# EAGLE design Prototipo_2.0 (EAGLE 6.1)
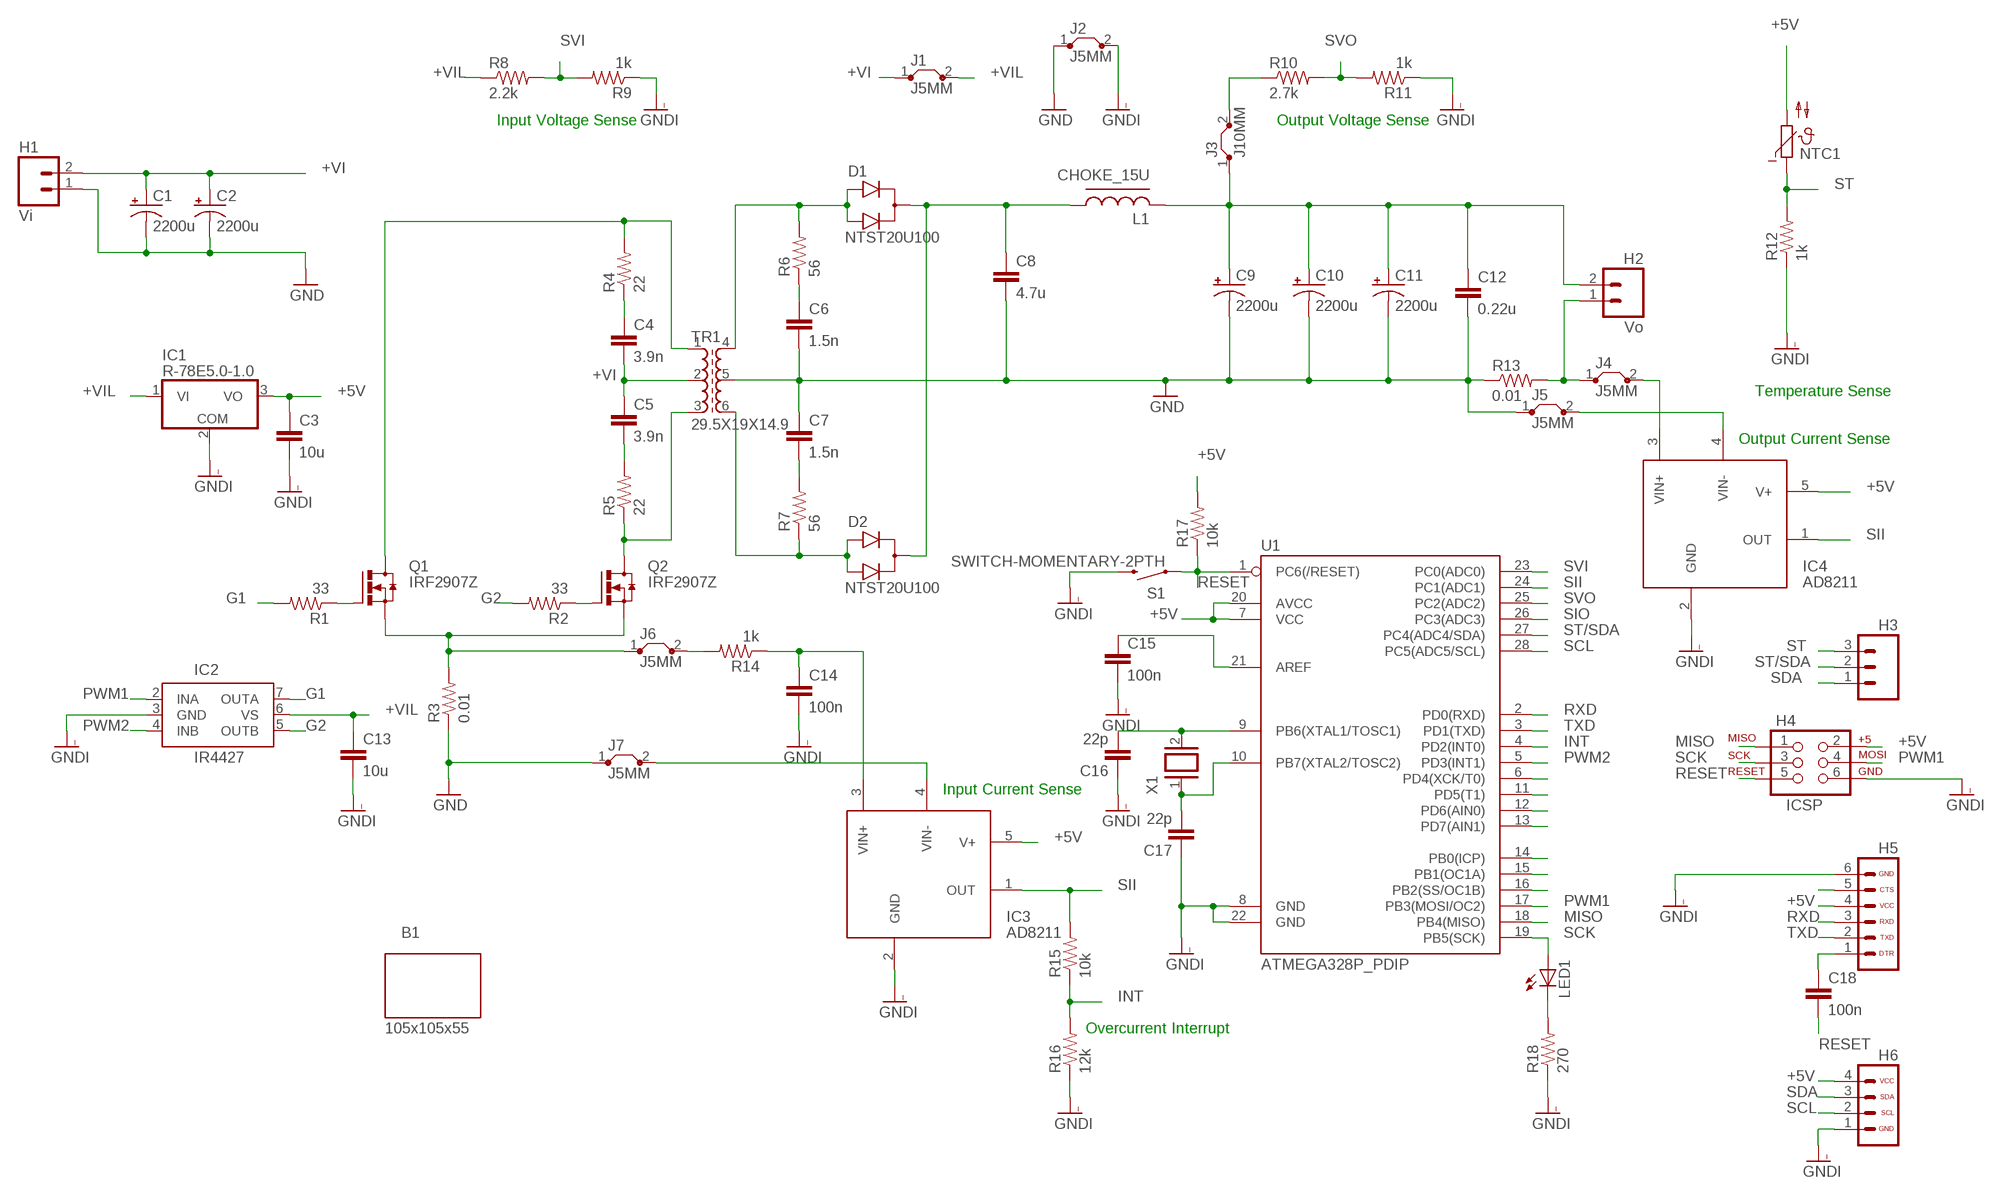
[diagram p0: schematic, sheet 1]

## Parts
B1  105x105x55  BOX_105X105X55  [BOX_105X105X55]
C1  2200u  CPOL_12.5MM_5MM  [CPOL_RADIAL_12.5MM_5MM]
C2  2200u  CPOL_12.5MM_5MM  [CPOL_RADIAL_12.5MM_5MM]
C3  10u  C5/2.5  [C5B2.5]
C4  3.9n  C7.5/3  [C7.5B3]
C5  3.9n  C7.5/3  [C7.5B3]
C6  1.5n  C7.5/3  [C7.5B3]
C7  1.5n  C7.5/3  [C7.5B3]
C8  4.7u  C5/2.5  [C5B2.5]
C9  2200u  CPOL_12.5MM_5MM  [CPOL_RADIAL_12.5MM_5MM]
C10  2200u  CPOL_12.5MM_5MM  [CPOL_RADIAL_12.5MM_5MM]
C11  2200u  CPOL_12.5MM_5MM  [CPOL_RADIAL_12.5MM_5MM]
C12  0.22u  C5/3  [C5B3]
C13  10u  C5/2.5  [C5B2.5]
C14  100n  C5/3  [C5B3]
C15  100n  C5/3  [C5B3]
C16  22p  C5/2.5  [C5B2.5]
C17  22p  C5/2.5  [C5B2.5]
C18  100n  C5/3  [C5B3]
D1  NTST20U100  NTST20U100CTG  [TO220V]
D2  NTST20U100  NTST20U100CTG  [TO220V]
H1  Vi  M025MM  [SCREWTERMINAL-5MM-2]
H2  Vo  M025MM  [SCREWTERMINAL-5MM-2]
H3  M03PTH  [1X03]
H4  ICSP  AVR_SPI_PRG_6PTH  [2X3]
H5  HEADER_SERIAL  [HEADER_SERIAL]
H6  HEADER_I2C  [HEADER_I2C]
IC1  R-78E5.0-1.0  [R-78E5.0-1.0]
IC2  IR4427  [DIL08]
IC3  AD8211  [RJ-5]
IC4  AD8211  [RJ-5]
J1  J5MM  [05]
J2  J5MM  [05]
J3  J10MM  [10]
J4  J5MM  [05]
J5  J5MM  [05]
J6  J5MM  [05]
J7  J5MM  [05]
L1  CHOKE_15U  [CHOKE_15U]
LED1  LED5MM  [LED5MM]
NTC1  NTC640  [P640]
Q1  IRF2907Z  [TO220V]
Q2  IRF2907Z  [TO220V]
R1  33  RESISTORPTH-1/4W  [AXIAL-0.4]
R2  33  RESISTORPTH-1/4W  [AXIAL-0.4]
R3  0.01  RSENSE  [RSENSE]
R4  22  RESISTORPTH-1/2W  [AXIAL-0.5]
R5  22  RESISTORPTH-1/2W  [AXIAL-0.5]
R6  56  RESISTORPTH-1/2W  [AXIAL-0.5]
R7  56  RESISTORPTH-1/2W  [AXIAL-0.5]
R8  2.2k  RESISTORPTH-1/4W  [AXIAL-0.4]
R9  1k  RESISTORPTH-1/4W  [AXIAL-0.4]
R10  2.7k  RESISTORPTH-1/4W  [AXIAL-0.4]
R11  1k  RESISTORPTH-1/4W  [AXIAL-0.4]
R12  1k  RESISTORPTH-1/4W  [AXIAL-0.4]
R13  0.01  RSENSE  [RSENSE]
R14  1k  RESISTORPTH-1/4W  [AXIAL-0.4]
R15  10k  RESISTORPTH-1/4W  [AXIAL-0.4]
R16  12k  RESISTORPTH-1/4W  [AXIAL-0.4]
R17  10k  RESISTORPTH-1/4W  [AXIAL-0.4]
R18  270  RESISTORPTH-1/4W  [AXIAL-0.4]
S1  SWITCH-MOMENTARY-2PTH  [TACTILE-PTH]
TR1  29.5X19X14.9  29.5X19X14.9_N87  [CORE_29.5X19X14.9]
U1  ATMEGA328P_PDIP  [DIL28-3]
X1  XTAL/S  [QS]

## Nets
$N1 [LVSHC]: C8.1 D1.2(C) D2.2(C) L1.1
+5V [LVLC]: C3.1 H4.2 H5.4(4_VCC) H6.4(4_VCC) IC1.3(VO) IC3.5(V+) IC4.5(V+) NTC1.2 R17.P$2 U1.7(VCC) U1.20(AVCC)
+VI [LVSHC]: C1.+ C2.+ C4.2 C5.1 H1.2 J1.1 TR1.2
+VIL [LVLC]: C13.1 IC1.1(VI) IC2.6(VS) J1.2 R8.P$1
G1 [LVLC]: IC2.7(OUTA) R1.P$2
G2 [LVLC]: IC2.5(OUTB) R2.P$2
GND [LVSHC]: C1.- C2.- C6.2 C7.1 C8.2 C9.- C10.- C11.- C12.2 H1.1 J2.1 J5.1 J7.1 R3.P$1 R13.P$1 TR1.5
GNDI [LVLC]: C3.2 C13.2 C14.2 C15.2 C16.1 C17.1 H4.6 H5.6(6_GND) H6.1(1_GND) IC1.2(COM) IC2.3(GND) IC3.2(GND) IC4.2(GND) J2.2 R9.P$1 R11.P$1 R12.P$1 R16.P$1 R18.P$1 S1.3 U1.8(GND) U1.22(GND)
INT [LVLC]: R15.P$1 R16.P$2 U1.4(PD2(INT0))
MISO [LVLC]: H4.1 U1.18(PB4(MISO))
N$1 [LVLC]: Q1.1(G) R1.P$1
N$2 [LVLC]: Q2.1(G) R2.P$1
N$3 [LVLC]: C18.1 H5.1(1_DTR)
N$4 [LVHC]: C7.2 R7.P$2
N$5 [LVHC]: C5.2 R5.P$2
N$6 [LVLC]: H5.5(5_CTS)
N$11 [LVLC]: U1.6(PD4(XCK/T0))
N$12 [LVLC]: U1.11(PD5(T1))
N$13 [LVLC]: U1.12(PD6(AIN0))
N$14 [LVLC]: U1.13(PD7(AIN1))
N$15 [LVLC]: U1.14(PB0(ICP))
N$16 [LVLC]: U1.15(PB1(OC1A))
N$17 [LVLC]: U1.16(PB2(SS/OC1B))
N$18 [LVLC]: J3.2 R10.P$1
N$69 [LVHC]: C6.1 R6.P$1
N$70 [LVHC]: D1.1(A1) D1.3(A2) R6.P$2 TR1.4
N$72 [LVHC]: D2.1(A1) D2.3(A2) R7.P$1 TR1.6
N$73 [LVSHC]: C9.+ C10.+ C11.+ C12.1 H2.2 J3.1 L1.2
N$75 [LVHC]: C4.1 R4.P$1
N$77 [LVHC]: Q1.2(D) R4.P$2 TR1.1
N$79 [LVHC]: Q2.2(D) R5.P$1 TR1.3
N$80 [LVSHC]: J6.1 Q1.3(S) Q2.3(S) R3.P$2
N$81 [LVSHC]: H2.1 J4.1 R13.P$2
N$82 [LVLC]: IC4.3(VIN+) J4.2
N$83 [LVLC]: IC4.4(VIN-) J5.2
N$84 [LVLC]: C14.1 IC3.3(VIN+) R14.P$1
N$85 [LVLC]: IC3.4(VIN-) J7.2
N$86 [LVLC]: J6.2 R14.P$2
N$87 [LVLC]: C16.2 U1.9(PB6(XTAL1/TOSC1)) X1.2
N$88 [LVLC]: C17.2 U1.10(PB7(XTAL2/TOSC2)) X1.1
N$90 [LVLC]: LED1.K(C) R18.P$2
N$92 [LVLC]: C15.1 U1.21(AREF)
PWM1 [LVLC]: H4.4 IC2.2(INA) U1.17(PB3(MOSI/OC2))
PWM2 [LVLC]: IC2.4(INB) U1.5(PD3(INT1))
RESET [LVLC]: C18.2 H4.5 R17.P$1 S1.1 U1.1(PC6(/RESET))
RXD [LVLC]: H5.3(3_RXD) U1.2(PD0(RXD))
SCK [LVLC]: H4.3 LED1.A U1.19(PB5(SCK))
SCL [LVLC]: H6.2(2_SCL) U1.28(PC5(ADC5/SCL))
SDA [LVLC]: H3.1 H6.3(3_SDA)
SII [LVLC]: IC3.1(OUT) IC4.1(OUT) R15.P$2 U1.24(PC1(ADC1))
SIO [LVLC]: U1.26(PC3(ADC3))
ST [LVLC]: H3.3 NTC1.1 R12.P$2
ST/SDA [LVLC]: H3.2 U1.27(PC4(ADC4/SDA))
SVI [LVLC]: R8.P$2 R9.P$2 U1.23(PC0(ADC0))
SVO [LVLC]: R10.P$2 R11.P$2 U1.25(PC2(ADC2))
TXD [LVLC]: H5.2(2_TXD) U1.3(PD1(TXD))

## Notes on the sheet
- Input Voltage Sense | Output Voltage Sense
- Temperature Sense
- Output Current Sense
- Input Current Sense
- Overcurrent Interrupt

## Library data of the parts
B1 = finger_sun:BOX_105X105X55
C1 C2 C9-C11 = finger_sun:CPOL_12.5MM_5MM; MOUSER: 667-EEU-FR1V222L
C3 C13 = capacitor-wima:C: CAPACITOR naming: grid - package width; MOUSER: 810-FK26X7R1C106K
C4 C5 = capacitor-wima:C: CAPACITOR naming: grid - package width; MOUSER: 594-K392K15X7RF53L2
C6 C7 = capacitor-wima:C: CAPACITOR naming: grid - package width; MOUSER: 581-SR151C152KAR
C8 = capacitor-wima:C: CAPACITOR naming: grid - package width; MOUSER: 81-RDEC71H475K2M1H3A
C12 = capacitor-wima:C: CAPACITOR naming: grid - package width; MOUSER: 80-R82DC3220AA60K
C14 C15 C18 = capacitor-wima:C: CAPACITOR naming: grid - package width; MOUSER: 80-R82DC3100AA50J
C16 C17 = capacitor-wima:C: CAPACITOR naming: grid - package width; MOUSER: 140-50N5-220J-RC
D1 D2 = finger_sun:NTST20U100CTG
H1 H2 = SparkFun-Connectors:M02: Header 2 Standard 2-pin 0.1" header. Use with straight break away headers (SKU : PRT-00116), right angle break away headers (PRT-00553), swiss pins (PRT-00743), machine pins (PRT-00117), and female headers (PRT-00115). Molex polarized connector foot print use with SKU : PRT-08233 with associated crimp pins and housings.
H3 = SparkFun-Connectors:M03: Header 3 Standard 3-pin 0.1" header. Use with straight break away headers (SKU : PRT-00116), right angle break away headers (PRT-00553), swiss pins (PRT-00743), machine pins (PRT-00117), and female headers (PRT-00115). Molex polarized connector foot print use with SKU : PRT-08232 with associated crimp pins and housings.
H4 = SparkFun-Connectors:AVR_SPI_PRG_6: AVR ISP 6 Pin This is the reduced ISP connector for AVR programming. Common on Arduino. This footprint will take up less PCB space and can be used with a 10-pin to 6-pin adapter such as SKU: BOB-08508 **Special note about "TEST_POINT" package. The stop mask is on the top side, so if you want your programming test points to be on the bottom of your board, make sure to place this package on the bottom side of the board. This also ensure that the orientation to program from the bottom side will be correct.
H5 = finger_sun:HEADER_SERIAL
H6 = finger_sun:HEADER_I2C
IC1 = finger_sun:R-78E5.0-1.0
IC2 = finger_sun:IR4427
IC3 IC4 = finger_sun:AD8211
J1-J7 = jumper:J: Bridge
L1 = finger_sun:CHOKE_15U; MOUSER: 652-2200LL-150-H-RC
LED1 = adafruit:LED: LED OSRAM: - CHIPLED LG R971, LG N971, LY N971, LG Q971, LY Q971, LO R971, LY R971 LH N974, LH R974 LS Q976, LO Q976, LY Q976 LO Q996 - Hyper CHIPLED LW Q18S LB Q993, LB Q99A, LB R99A - SideLED LS A670, LO A670, LY A670, LG A670, LP A670 LB A673, LV A673, LT A673, LW A673 LH A674 LY A675 LS A676, LA A676, LO A676, LY A676, LW A676 LS A679, LY A679, LG A679 - Hyper Micro SIDELED® LS Y876, LA Y876, LO Y876, LY Y876 LT Y87S - SmartLED LW L88C, LW L88S LB L89C, LB L89S, LG L890 LS L89K, LO L89K, LY L89K LS L896, LA L896, LO L896, LY L896 - TOPLED LS T670, LO T670, LY T670, LG T670, LP T670 LSG T670, LSP T670, LSY T670, LOP T670, LYG T670 LG T671, LOG T671, LSG T671 LB T673, LV T673, LT T673, LW T673 LH T674 LS T676, LA T676, LO T676, LY T676, LB T676, LH T676, LSB T676, LW T676 LB T67C, LV T67C, LT T67C, LS T67K, LO T67K, LY T67K, LW E67C LS E67B, LA E67B, LO E67B, LY E67B, LB E67C, LV E67C, LT E67C LW T67C LS T679, LY T679, LG T679 LS T770, LO T770, LY T770, LG T770, LP T770 LB T773, LV T773, LT T773, LW T773 LH T774 LS E675, LA E675, LY E675, LS T675 LS T776, LA T776, LO T776, LY T776, LB T776 LHGB T686 LT T68C, LB T68C - Hyper Mini TOPLED® LB M676 - Mini TOPLED Santana® LG M470 LS M47K, LO M47K, LY M47K Source: http://www.osram.convergy.de/
NTC1 = ptc-ntc:NTC640: PHILIPS NTC; MOUSER: 594-NTCLE203E3502JB0; OC_FARNELL: unknown; OC_NEWARK: unknown
Q1 Q2 = finger_sun:IRF2907Z
R1 R2 = SparkFun-Passives:RESISTOR: Resistor Basic schematic elements and footprints for 0603, 1206, and PTH resistors.; MOUSER: 660-MF14DCT52R33R0F
R3 R13 = finger_sun:RSENSE: Open Air Sense Resistor - TT Electronics; MOUSER: 5W_66-OAR5R010JLF
R4 R5 = SparkFun-Passives:RESISTOR: Resistor Basic schematic elements and footprints for 0603, 1206, and PTH resistors.; MOUSER: 603-MFR50SFTE52-22R
R6 R7 = SparkFun-Passives:RESISTOR: Resistor Basic schematic elements and footprints for 0603, 1206, and PTH resistors.; MOUSER: 603-MFR50SFTE52-56R
R8 R9 R11 R12 R14 = SparkFun-Passives:RESISTOR: Resistor Basic schematic elements and footprints for 0603, 1206, and PTH resistors.; MOUSER: 660-MF1/4DC1001F
R10 = SparkFun-Passives:RESISTOR: Resistor Basic schematic elements and footprints for 0603, 1206, and PTH resistors.
R15 R17 = SparkFun-Passives:RESISTOR: Resistor Basic schematic elements and footprints for 0603, 1206, and PTH resistors.; MOUSER: 660-MF1/4DC1002F
R16 = SparkFun-Passives:RESISTOR: Resistor Basic schematic elements and footprints for 0603, 1206, and PTH resistors.; MOUSER: 660-MF1/4DCT52R1202F
R18 = SparkFun-Passives:RESISTOR: Resistor Basic schematic elements and footprints for 0603, 1206, and PTH resistors.; MOUSER: 660-MF1/4DC2700F
S1 = SparkFun-Electromechanical:SWITCH-MOMENTARY-2: Various NO switches- pushbuttons, reed, etc; PROD_ID: SWCH-08441
TR1 = finger_sun:29.5X19X14.9_N87
U1 = SparkFun-DigitalIC:ATMEGA328P_PDIP: uC used in the Arduino 32kb flash, 1k EEPROM, 2k SRAM This is the through-hole version of this chip.; MOUSER: 556-ATMEGA328P-PU
X1 = special:XTAL/S: CRYSTAL

## Net classes
0 HVLC: clearance 0.762 mm
1 HVHC: width 0.762 mm, clearance 1.016 mm to class 0, clearance 1.016 mm
2 LVHC: width 2.54 mm, clearance 5.08 mm to class 0, clearance 5.08 mm to class 1
3 LVLC: width 0.381 mm, clearance 1 mm to class 0, clearance 5.08 mm to class 1, clearance 0.381 mm
4 LVSHC: width 4.572 mm, clearance 4.572 mm to class 0, clearance 4.572 mm to class 1
5 HVMC: width 0.762 mm, clearance 0.762 mm to class 0, clearance 1.27 mm to class 1, clearance 5.08 mm to class 2, clearance 5.08 mm to class 3, clearance 5.08 mm to class 4, clearance 0.889 mm

## Board
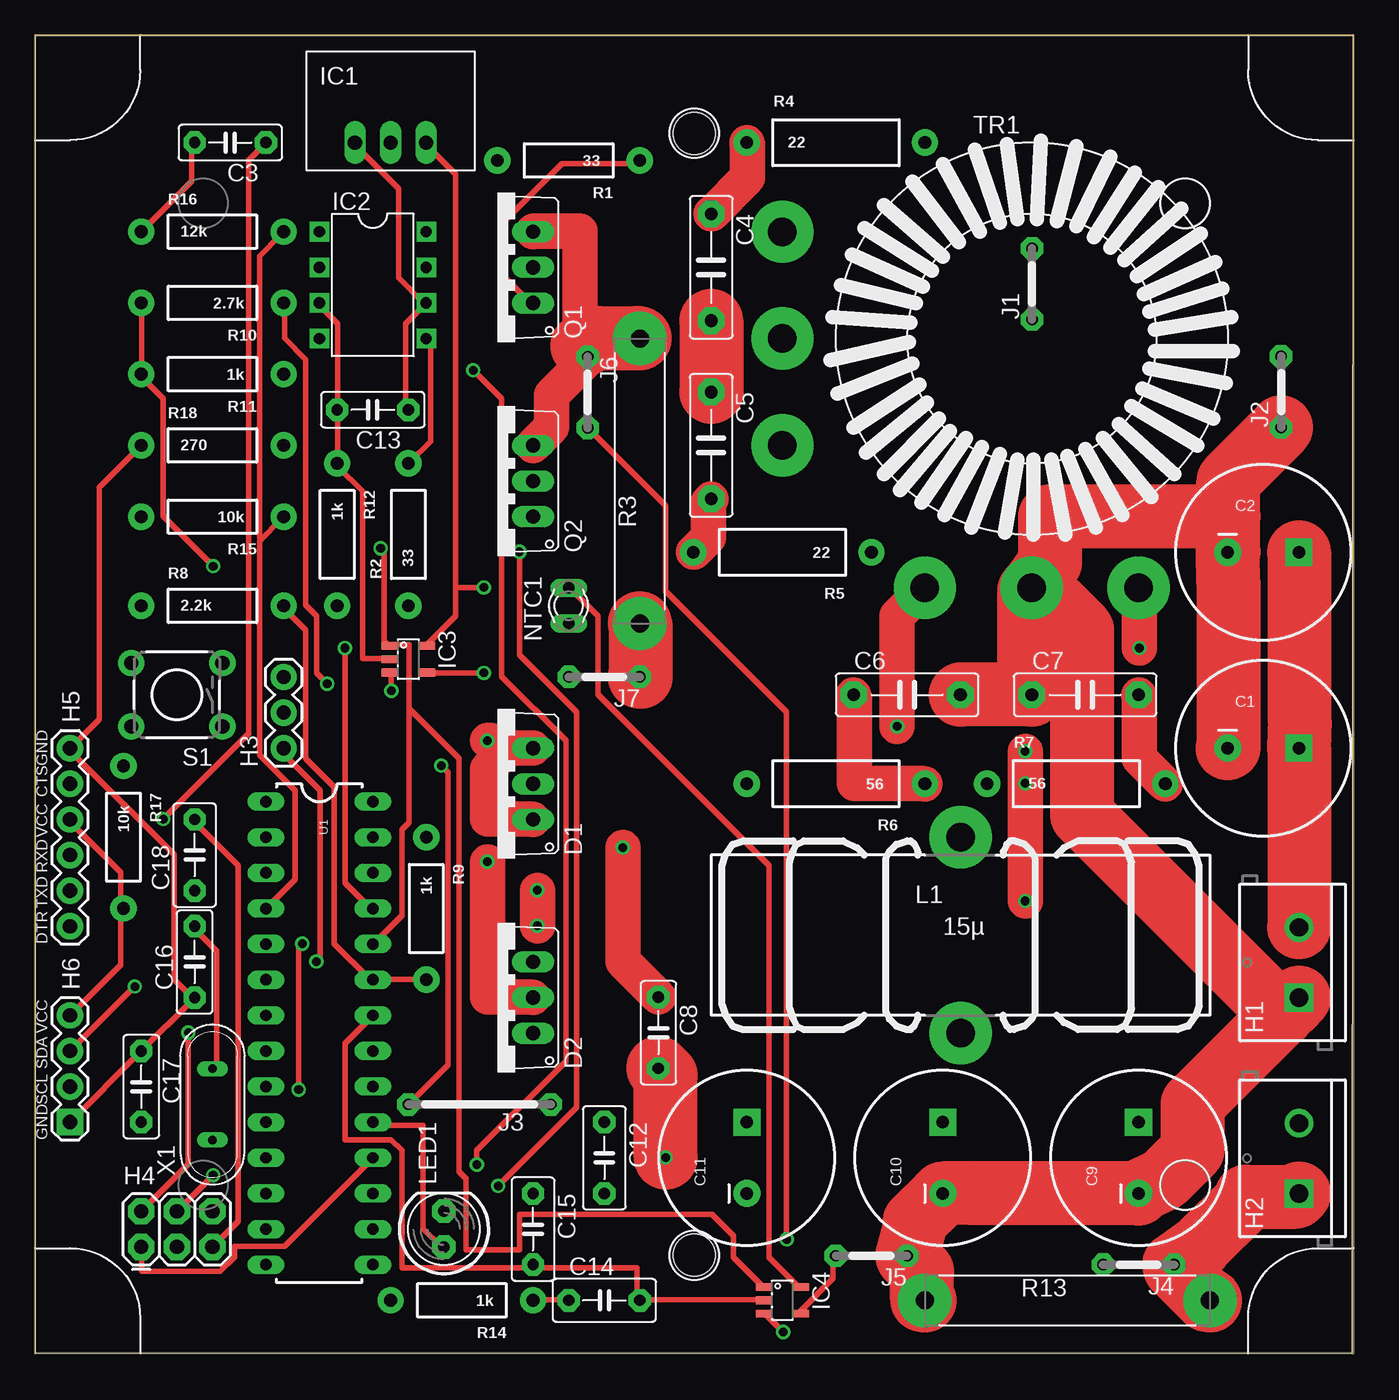
[diagram p1: board, top side]
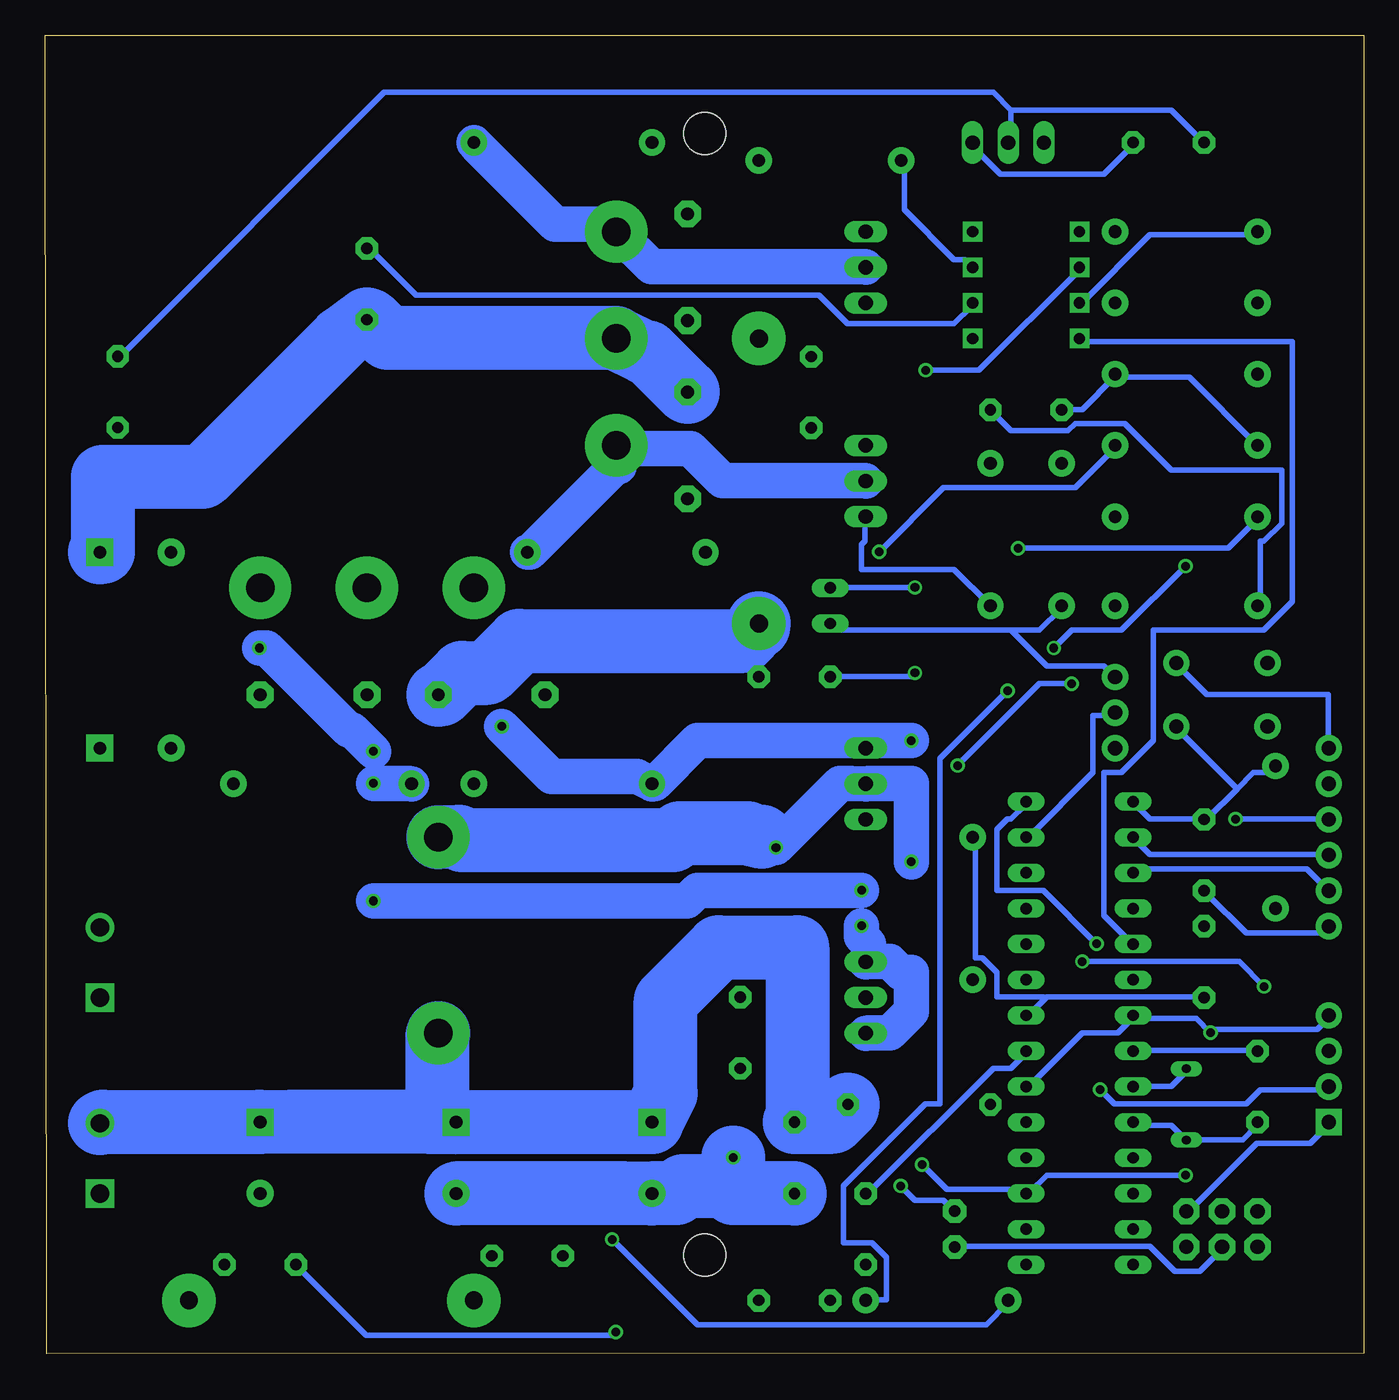
[diagram p2: board, bottom side, seen from below]

Size 94 x 94.03 mm. Coordinates in mm from the lower left corner, seen from the top.
Outline: 0,0.03 93.91,0 94,94.03 0,94.03 0,0.03
Copper layers (1*16): Top 0.035mm / dielectric 1.5mm / Bottom 0.035mm
Design rules: minimum track width 5mil, minimum drill 24mil, track to track 15mil, track to pad 15mil, pad to pad 15mil, via to via 15mil, smd to smd 15mil, copper to edge 40mil, drill to drill 8mil, minimum pad ring 10mil, minimum via ring 8mil, stop-mask expansion 4mil, vias tented up to drill 0mil, thermal gap 10mil
Holes 3 mm at 47,87.03 47,7.03
tRestrict: area 45,85.1 to 48.8,88.9; area 45,5.1 to 48.8,8.9; area 87.6,1.9 to 92.7,6.4; area 87.6,87.6 to 92.7,92.7; area 39.4,35.6 to 40.6,45.8; area 39.4,20.4 to 40.6,30.5; area 31.7,7.7 to 34.3,11.5
bRestrict: area 45,85.1 to 48.8,88.9; area 45,5.1 to 48.8,8.9; area 87.6,1.9 to 92.7,6.4; area 87.6,87.6 to 92.7,92.7

### Footprints (pad centres in the part's own frame; a part is rotated, then mirrored left to right if it is on the bottom)
CPOL_RADIAL_12.5MM_5MM = drill 0.9 pad 1.93 square: + 2.54,0 | drill 0.9 pad 1.93: - -2.54,0
C5B2.5 = drill 0.813 pad 1.6 octagon: 1 -2.54,0; 2 2.54,0
C7.5B3 = drill 0.914 pad 1.905 octagon: 1 -3.81,0; 2 3.81,0
C5B3 = drill 0.813 pad 1.6 octagon: 1 -2.54,0; 2 2.54,0
TO220V = drill 1.016 long: 1 -2.54,-2.54; 2 0,-2.54; 3 2.54,-2.54
SCREWTERMINAL-5MM-2 = drill 1.3 pad 2.032 square: 1 0,0 | drill 1.3 pad 2.032: 2 5,0
1X03 = drill 1.016 pad 1.88: 1 0,0; 2 2.54,0; 3 5.08,0
2X3 = drill 1.016 pad 1.88 octagon: 1 0,0; 2 0,2.54; 3 2.54,0; 4 2.54,2.54; 5 5.08,0; 6 5.08,2.54
HEADER_SERIAL = drill 1.016 pad 1.88: 1 0,0; 2 0,2.54; 3 0,5.08; 4 0,7.62; 5 0,10.16; 6 0,12.7
HEADER_I2C = drill 1.016 pad 1.88 square: 1 0,0 | drill 1.016 pad 1.88: 2 0,2.54; 3 0,5.08; 4 0,7.62
R-78E5.0-1.0 = drill 1.016 long: 1 -2.54,0; 2 0,0; 3 2.54,0
DIL08 = drill 0.8 pad 1.4 square: 1 -3.81,-3.81; 2 -1.27,-3.81; 3 1.27,-3.81; 4 3.81,-3.81; 5 3.81,3.81; 6 1.27,3.81; 7 -1.27,3.81; 8 -3.81,3.81
RJ-5 = smd 0.55 x 1.2: 1 -0.95,-1.3; 2 0,-1.3; 3 0.95,-1.3; 4 0.95,1.3; 5 -0.95,1.3
05 = drill 0.813 pad 1.6 octagon: 1 -2.54,0; 2 2.54,0
10 = drill 0.813 pad 1.6 octagon: 1 -5.08,0; 2 5.08,0
CHOKE_15U = drill 2.032 pad 4.445: 1 0,0; 2 0,-13.97
LED5MM = drill 0.813 pad 1.676 octagon: A -1.27,0; K 1.27,0
P640 = drill 0.813 long: 1 -1.27,0; 2 1.27,0
AXIAL-0.4 = drill 0.9 pad 1.88: P$1 -5.08,0; P$2 5.08,0
RSENSE = drill 1.27 pad 3.81: P$1 -10.16,0; P$2 10.16,0
AXIAL-0.5 = drill 0.9 pad 1.88: P$1 -6.35,0; P$2 6.35,0
TACTILE-PTH = drill 1.016 pad 1.88: 1 -3.251,2.261; 2 3.251,2.261; 3 -3.251,-2.261; 4 3.251,-2.261
CORE_29.5X19X14.9 = drill 2.032 pad 4.445: 1 -17.78,7.62; 2 -17.78,0; 3 -17.78,-7.62; 4 -7.62,-17.78; 5 0,-17.78; 6 7.62,-17.78
DIL28-3 = drill 0.813 long: 1 -16.51,-3.81; 2 -13.97,-3.81; 3 -11.43,-3.81; 4 -8.89,-3.81; 5 -6.35,-3.81; 6 -3.81,-3.81; 7 -1.27,-3.81; 8 1.27,-3.81; 9 3.81,-3.81; 10 6.35,-3.81; 11 8.89,-3.81; 12 11.43,-3.81; 13 13.97,-3.81; 14 16.51,-3.81; 15 16.51,3.81; 16 13.97,3.81; 17 11.43,3.81; 18 8.89,3.81; 19 6.35,3.81; 20 3.81,3.81; 21 1.27,3.81; 22 -1.27,3.81; 23 -3.81,3.81; 24 -6.35,3.81; 25 -8.89,3.81; 26 -11.43,3.81; 27 -13.97,3.81; 28 -16.51,3.81
QS = drill 0.61 long: 1 -2.54,0; 2 2.54,0

### Placement (x,y rotation side)
B1  47,47.03 0 top
C1  87.58,43.18 0 top
C2  87.58,57.15 0 top
C3  13.92,86.36 180 top
C4  48.21,77.47 270 top
C5  48.21,64.77 270 top
C6  62.18,46.99 0 top
C7  74.88,46.99 0 top
C8  44.45,22.89 270 top
C9  78.69,13.97 90 top
C10  64.72,13.97 90 top
C11  50.75,13.97 90 top
C12  40.59,13.97 270 top
C13  24.08,67.31 180 top
C14  40.59,3.81 0 top
C15  35.51,8.89 270 top
C16  11.38,27.94 90 top
C17  7.57,19.05 270 top
C18  11.38,35.56 90 top
D1  32.97,40.64 90 top
D2  32.97,25.4 90 top
H1  90.12,25.4 90 top
H2  90.12,11.43 90 top
H3  17.73,43.18 90 top
H4  7.57,7.62 0 top
H5  2.49,30.48 0 top
H6  2.49,16.51 0 top
IC1  25.35,86.36 0 top
IC2  24.08,76.2 270 top
IC3  26.62,49.53 270 top
IC4  53.29,3.81 270 top
J1  71.09,76.28 90 top
J2  88.85,68.58 90 top
J3  31.7,17.78 180 top
J4  78.69,6.35 180 top
J5  59.64,6.99 180 top
J6  39.4,68.56 270 top
J7  40.59,48.26 180 top
L1  65.99,36.83 0 top
LED1  29.16,8.89 90 top
NTC1  38.05,53.34 90 top
Q1  32.97,77.47 90 top
Q2  32.97,62.23 90 top
R1  38.05,85.09 180 top
R2  26.62,58.42 90 top
R3  43.13,62.23 90 top
R4  57.1,86.36 0 top
R5  53.29,57.15 180 top
R6  57.1,40.64 180 top
R7  74.25,40.64 0 top
R8  12.65,53.34 0 top
R9  27.89,31.75 270 top
R10  12.65,74.93 180 top
R11  12.65,69.85 180 top
R12  21.54,58.42 270 top
R13  73.61,3.81 0 top
R14  30.43,3.81 180 top
R15  12.65,59.69 180 top
R16  12.65,80.01 0 top
R17  6.3,36.83 270 top
R18  12.65,64.77 0 top
S1  10.11,46.99 180 top
TR1  71.07,72.39 0 top
U1  20.27,22.86 270 top
X1  12.65,17.78 90 top

### Tracks (layer width: path | path; a pad name or v marks a point on that pad's centre or on a via)
$N1  (via drill 0.61)
  Top 2.54: v32.26,35.08 32.26,25.43 35.31,25.43 D2.2 | C8.1 41.91,27.97 v41.91,36.1
  Bottom 2.54: v32.26,35.08 32.26,40.67 35.31,40.67 D1.2 36.58,40.67 37.34,40.67 v41.91,36.1 42.93,36.86 | 65.79,36.86 L1.1
  Bottom 4.572: L1.1 64.52,36.86 64.26,36.61 49.28,36.61 48.77,37.11 43.94,37.11 42.93,36.86
+5V  (via drill 0.61)
  Top 0.381: H6.4 2.54,24.16 6.1,27.72 6.1,31.53 R17.P$2 6.1,31.78 6.1,34.32 2.54,37.88 H5.4 | v10.92,22.89 10.92,13.49 7.62,10.19 H4.2 | 29.97,54.64 29.97,84.1 27.94,86.14 IC1.3 | 29.97,54.64 29.97,52.61 27.94,50.58 IC3.5 | IC4.5 54.36,4.86 52.32,6.89 52.32,34.83 40.13,47.02 40.13,52.61 38.1,54.64 NTC1.2 | v32,54.64 29.97,54.64 | v9.14,38.13 15.24,44.23 15.24,85.12 16.26,86.14 C3.1
  Bottom 0.381: U1.20 23.88,19.08 20.07,22.89 17.53,22.89 16.51,23.91 U1.7 16.26,23.91 11.94,23.91 v10.92,22.89 10.92,23.14 3.3,23.14 2.54,23.91 H6.4 | C3.1 16.51,86.14 18.54,84.1 25.91,84.1 27.94,86.14 IC1.3 | v32,54.64 37.85,54.64 NTC1.2 | v9.14,38.13 2.54,38.13 H5.4
+VI
  Top 4.572: H1.2 90.17,30.51 90.17,42.96 C1.+ 90.17,45.24 90.17,56.93 C2.+ | C4.2 48.26,73.44 48.26,68.61 C5.1
  Bottom 4.572: C5.1 48.26,68.61 51.05,71.4 51.31,71.4 TR1.2 53.34,72.42 69.6,72.42 70.87,73.69 J1.1 72.9,72.42 82.8,62.51 89.92,62.51 89.92,57.18 C2.+
+VIL
  Top 0.381: C13.1 26.42,67.34 26.42,73.44 27.69,74.71 IC2.6 27.69,74.96 25.91,76.74 25.91,83.09 22.86,86.14 IC1.1
  Bottom 0.381: J1.2 70.87,78.77 67.56,75.47 38.86,75.47 36.83,73.44 29.21,73.44 27.94,74.71 IC2.6 | R8.P$1 7.37,53.37 7.37,57.94 7.11,57.94 5.84,59.21 5.84,63.02 13.72,63.02 17.02,66.32 20.57,66.32 21.08,65.82 25.15,65.82 26.42,67.09 C13.1
G1
  Bottom 0.381: IC2.7 27.94,77.5 28.45,78.01 29.21,78.01 32.77,81.56 32.77,84.87 R1.P$2
G2
  Top 0.381: IC2.5 27.94,72.17 28.19,71.91 28.19,65.05 26.67,63.53 R2.P$2
GND  (via drill 0.61)
  Top 4.572: 85.09,59.72 85.09,57.18 C2.- 85.09,54.89 85.09,43.21 C1.- | 85.09,59.72 85.09,62.26 88.65,65.82 J2.1 | J7.1 43.18,48.29 43.18,51.85 R3.P$1 | 70.87,47.02 66.04,47.02 C6.2 | 70.87,47.02 C7.1 | 70.87,47.02 70.87,54.39 TR1.5 | 85.09,59.72 72.39,59.72 72.39,56.42 TR1.5 | C8.2 44.96,19.84 v44.96,14 | R13.P$1 63.25,3.84 63.25,5.87 62.23,6.89 J5.1 62.74,9.17 62.74,9.43 64.52,11.21 C10.- 66.8,11.46 78.49,11.46 | 78.49,11.46 C9.- | 88.9,24.16 82.55,17.81 82.55,14.51 80.52,12.48 78.49,11.46 | 88.9,24.16 89.92,25.18 H1.1 | 88.9,24.16 74.68,38.38 74.68,51.59 72.9,53.37 TR1.5
  Bottom 4.572: R3.P$1 43.18,51.85 44.2,50.83 60.2,50.83 62.48,48.54 64.26,48.54 65.79,47.02 C6.2 | 45.47,11.97 44.96,11.46 40.64,11.46 C12.2 | 45.47,11.97 48.51,11.97 49.02,11.46 50.55,11.46 C11.- 52.83,11.46 64.52,11.46 C10.- | v44.96,14 45.47,11.97
GNDI
  Top 0.381: H6.1 2.54,16.54 7.37,21.37 C17.1 7.62,21.62 11.18,25.18 C16.1 11.18,25.43 9.91,26.7 9.91,35.59 2.54,42.96 H5.6 2.54,43.21 4.57,45.24 4.57,61.75 7.37,64.55 R18.P$1 | IC4.2 51.82,3.84 43.18,3.84 C14.2 42.93,3.84 42.93,6.13 35.56,6.13 C15.2 35.31,6.13 26.16,6.13 26.16,14.51 25.4,15.27 22.1,15.27 22.1,22.13 23.88,23.91 U1.22 | IC2.3 20.32,74.71 21.59,73.44 21.59,67.34 C13.2 21.59,67.09 21.59,63.53 R12.P$1 21.59,63.28 23.37,61.5 23.37,49.56 25.15,49.56 IC3.2 | R16.P$1 7.62,80.04 11.18,83.6 11.18,86.14 C3.2
  Bottom 0.381: U1.8 16.26,21.62 7.62,21.62 C17.1 | H4.6 12.45,10.19 7.62,15.02 3.81,15.02 2.54,16.29 H6.1 | H5.6 2.54,43.21 2.54,47.02 11.18,47.02 13.21,49.05 S1.3 | 22.73,25.3 22.61,25.43 11.43,25.43 C16.1 | 22.73,25.3 23.88,24.16 U1.22 | R9.P$1 27.69,36.61 27.69,28.22 27.18,28.22 26.16,27.21 26.16,25.43 22.86,25.43 22.73,25.3 | R18.P$1 7.62,64.8 12.45,69.63 17.53,69.63 R11.P$1 17.78,69.63 20.07,67.34 21.34,67.34 C13.2 | 25.15,88.68 25.15,86.39 IC1.2 | 25.15,88.68 13.72,88.68 11.43,86.39 C3.2 | 25.15,88.68 26.42,89.95 69.85,89.95 88.65,71.15 J2.2 | IC2.3 20.07,74.96 15.24,79.79 7.62,79.79 R16.P$1
INT
  Top 0.381: 16.13,58.07 17.53,59.47 R15.P$1 | 16.13,58.07 16,57.94 16,42.7 18.54,40.16 18.54,33.81 16.51,31.78 U1.4 | R16.P$2 17.53,79.79 16,78.26 16,58.2 16.13,58.07
MISO
  Top 0.381: U1.18 23.88,13.75 17.78,7.65 14.22,7.65 14.22,6.89 13.21,5.87 7.62,5.87 7.62,7.4 H4.1
N$1
  Top 0.381: Q1.1 35.31,74.96 33.27,76.99 33.27,80.55 37.59,84.87 42.93,84.87 R1.P$1
N$2
  Bottom 0.381: Q2.1 35.56,59.47 35.56,57.94 35.81,57.69 35.81,55.91 29.21,55.91 26.67,53.37 R2.P$1
N$3
  Bottom 0.381: C18.1 11.18,32.8 8.38,30 2.79,30 2.54,30.26 H5.1
N$4
  Top 2.54: R7.P$2 80.52,40.67 78.74,42.45 78.74,46.77 C7.2
N$5
  Top 2.54: R5.P$2 46.99,57.18 48.01,58.2 48.01,60.74 C5.2
N$18  (via drill 0.61)
  Top 0.381: v28.96,41.94 29.46,41.43 29.46,20.6 26.67,17.81 J3.2 | v20.83,47.78 20.07,48.54 20.07,52.61 19.3,53.37 19.3,70.9 17.78,72.42 17.78,74.71 R10.P$1
  Bottom 0.381: v28.96,41.94 23.11,47.78 v20.83,47.78
N$69
  Top 2.54: R6.P$1 63.25,40.67 58.42,40.67 58.42,46.77 C6.1
N$70  (via drill 0.61)
  Top 2.54: 33.4,42.83 33.78,43.21 35.31,43.21 D1.3 | 33.4,42.83 32.26,41.69 32.26,38.13 35.31,38.13 D1.1 | v32.26,43.72 32.51,43.72 33.4,42.83 | v61.47,44.73 61.47,52.61 63.25,54.39 TR1.4
  Bottom 2.54: v32.26,43.72 47.5,43.72 50.55,40.67 R6.P$2 51.82,41.18 57.91,41.18 v61.47,44.73
N$72  (via drill 0.61)
  Top 2.54: v70.61,42.96 v70.61,40.67 v70.61,32.29 | v78.74,50.32 78.74,54.39 TR1.6 | v35.81,33.05 v35.81,30.51
  Bottom 2.54: 35.31,27.97 33.78,27.97 33.02,27.21 32.26,27.21 32.26,24.41 33.78,22.89 35.31,22.89 D2.1 | 35.31,27.97 D2.3 | v70.61,40.67 68.07,40.67 R7.P$1 | v70.61,42.96 72.14,44.48 72.39,44.48 78.23,50.32 v78.74,50.32 | v35.81,30.51 35.81,29.75 35.31,29.24 35.31,27.97 | v35.81,33.05 47.5,33.05 48.26,32.29 v70.61,32.29
N$73
  Bottom 4.572: H2.2 89.92,16.54 78.74,16.54 C9.+ 76.45,16.54 66.8,16.54 | 40.39,16.54 37.85,16.54 36.83,17.56 J3.1 | 40.39,16.54 C12.1 | 50.8,16.54 64.52,16.54 C10.+ 66.8,16.54 | 50.8,16.54 C11.+ | 40.39,16.54 40.39,28.99 45.97,28.99 49.78,25.18 49.78,18.57 50.8,16.54 | L1.2 66.04,22.64 66.04,18.57 66.8,16.54
N$75
  Top 2.54: R4.P$1 50.8,86.14 50.8,83.85 48.26,81.31 C4.1
N$77
  Bottom 2.54: Q1.2 35.56,77.5 50.8,77.5 53.09,79.79 TR1.1 54.36,80.55 57.66,80.55 63.25,86.14 R4.P$2
N$79
  Bottom 2.54: Q2.2 35.56,62.26 45.72,62.26 48.01,64.55 53.09,64.55 TR1.3 53.09,63.28 53.34,63.28 59.44,57.18 R5.P$1
N$80
  Top 2.54: Q2.3 35.56,64.8 36.83,66.07 36.83,68.36 39.37,70.9 J6.1 39.02,71.86 38.86,72.17 38.86,80.04 35.56,80.04 Q1.3
  Top 4.572: R3.P$2 42.93,72.42 40.13,72.42 39.02,71.86
N$81
  Top 4.572: R13.P$2 83.57,3.84 81.28,6.13 J4.1 83.06,7.65 86.36,10.95 86.36,11.21 89.92,11.21 H2.1
N$82  (via drill 0.61)
  Top 0.381: v53.34,1.55 52.07,2.82 IC4.3
  Bottom 0.381: v53.34,1.55 53.59,1.3 71.12,1.3 75.95,6.13 J4.2
N$83
  Top 0.381: IC4.4 54.61,3.08 56.9,5.36 56.9,6.89 J5.2
N$84  (via drill 0.61)
  Top 0.381: v25.4,47.27 25.4,48.54 IC3.3 | C14.1 37.85,3.84 35.56,3.84 R14.P$1
  Bottom 0.381: v25.4,47.27 30.23,42.45 30.23,17.81 31.24,17.81 37.08,11.97 37.08,7.9 35.05,7.9 34.04,6.89 34.04,3.84 35.31,3.84 R14.P$1
N$85  (via drill 0.61)
  Top 0.381: v32,48.54 27.94,48.54 IC3.4
  Bottom 0.381: v32,48.54 32.26,48.29 37.85,48.29 J7.2
N$86  (via drill 0.61)
  Top 0.381: v53.59,8.16 53.59,45.75 44.96,54.39 44.96,60.48 39.62,65.82 J6.2
  Bottom 0.381: v53.59,8.16 47.5,2.06 26.92,2.06 25.4,3.59 R14.P$2
N$87
  Top 0.381: C16.2 11.43,30.26 12.95,28.73 12.95,20.6 12.7,20.35 X1.2
  Bottom 0.381: X1.2 12.7,20.1 13.72,19.08 16.26,19.08 U1.9
N$88
  Bottom 0.381: U1.10 16.26,16.29 13.72,16.29 12.7,15.27 X1.1 12.45,15.27 8.64,15.27 7.62,16.29 C17.2
N$90  (via drill 0.61)
  Top 0.381: v33.02,11.97 38.61,17.56 38.61,45.75 34.54,49.81 v34.54,57.18
  Bottom 0.381: v33.02,11.97 32,10.95 29.97,10.95 29.21,10.19 LED1.K | v34.54,57.18 29.97,61.75 20.57,61.75 17.78,64.55 R18.P$2
N$92
  Bottom 0.381: U1.21 24.13,21.37 25.15,20.35 26.42,20.35 35.31,11.46 C15.1
PWM1  (via drill 0.61)
  Top 0.381: v12.7,12.73 10.16,10.19 H4.4 | v31.24,70.13 33.27,68.1 33.27,48.29 37.85,43.72 37.85,20.86 31.5,14.51 v31.5,13.49
  Bottom 0.381: v12.7,12.73 22.61,12.73 23.88,11.46 U1.17 23.88,11.71 29.72,11.71 v31.5,13.49 | v31.24,70.13 27.43,70.13 20.32,77.25 IC2.2
PWM2
  Bottom 0.381: U1.5 16.51,29.24 18.54,31.27 18.54,41.43 17.27,41.43 14.99,43.72 14.99,51.59 7.11,51.59 5.08,53.62 5.08,72.17 20.07,72.17 IC2.4
RESET
  Top 0.381: H4.5 12.7,7.65 14.48,9.43 14.48,34.83 11.43,37.88 C18.2
  Bottom 0.381: U1.1 16.26,39.15 15.24,38.13 11.43,38.13 C18.2 11.18,38.13 9.02,40.29 | 9.02,40.29 7.87,41.43 6.6,41.43 6.35,41.69 R17.P$1 | 9.02,40.29 13.21,44.48 S1.1
RXD
  Bottom 0.381: U1.2 16.26,36.61 15.24,35.59 2.54,35.59 H5.3
SCK
  Top 0.381: U1.19 24.13,16.29 27.69,16.29 27.69,8.92 28.96,7.65 LED1.A
  Bottom 0.381: H4.3 10.16,7.4 11.68,5.87 13.46,5.87 15.24,7.65 28.96,7.65 LED1.A
SCL  (via drill 0.61)
  Top 0.381: v19.05,29.24 18.8,28.99 v18.8,18.83
  Bottom 0.381: v19.05,29.24 22.86,33.05 26.16,33.05 26.16,37.37 25.4,38.13 25.15,38.13 24.13,39.15 U1.28 | v18.8,18.83 17.78,17.81 8.38,17.81 7.37,18.83 2.54,18.83 H6.2
SDA  (via drill 0.61)
  Top 0.381: v7.11,26.19 2.54,21.62 H6.3 | v20.07,27.97 20.32,28.22 20.32,40.16 17.78,42.7 17.78,42.96 H3.1
  Bottom 0.381: v7.11,26.19 8.89,27.97 v20.07,27.97
SII  (via drill 0.61)
  Top 0.381: 26.67,46 26.67,37.88 26.16,37.37 26.16,31.27 24.13,29.24 U1.24 | 26.67,46 26.67,50.58 25.4,50.58 IC3.1 25.15,50.58 24.89,50.83 24.89,57.18 v24.64,57.43 | 26.67,46 30.23,42.45 30.23,12.98 30.73,12.48 30.73,7.4 34.54,7.4 34.54,9.94 48.26,9.94 49.78,8.41 49.78,6.89 51.82,4.86 IC4.1
  Bottom 0.381: v24.64,57.43 9.65,57.43 7.62,59.47 R15.P$2
ST
  Bottom 0.381: 25.15,51.59 23.11,51.59 21.59,53.12 R12.P$2 | 25.15,51.59 37.59,51.59 37.85,51.85 NTC1.1 | 25.15,51.59 22.61,49.05 18.54,49.05 17.78,48.29 H3.3
ST/SDA
  Bottom 0.381: U1.27 23.88,36.86 19.3,41.43 19.3,45.5 17.78,45.5 H3.2
SVI
  Top 0.381: R9.P$2 27.69,26.7 24.13,26.7 U1.23 23.88,26.7 21.34,29.24 21.34,40.42 19.3,42.45 19.3,51.59 17.78,53.12 R8.P$2
SVO  (via drill 0.61)
  Top 0.381: v22.1,50.32 22.1,33.56 23.88,31.78 U1.25 | v12.7,56.16 9.14,59.72 9.14,68.1 7.62,69.63 R11.P$2 7.62,69.88 7.62,74.71 R10.P$2
  Bottom 0.381: v22.1,50.32 20.83,51.59 17.27,51.59 v12.7,56.16
TXD
  Bottom 0.381: U1.3 16.26,34.32 16,34.57 4.06,34.57 2.54,33.05 H5.2

### Text on the board
tValues: ST | SDA | + | - | + | - | VCC | RESET